# Altium schematic sheet AD9959_OUTPUT.SchDoc
size A4
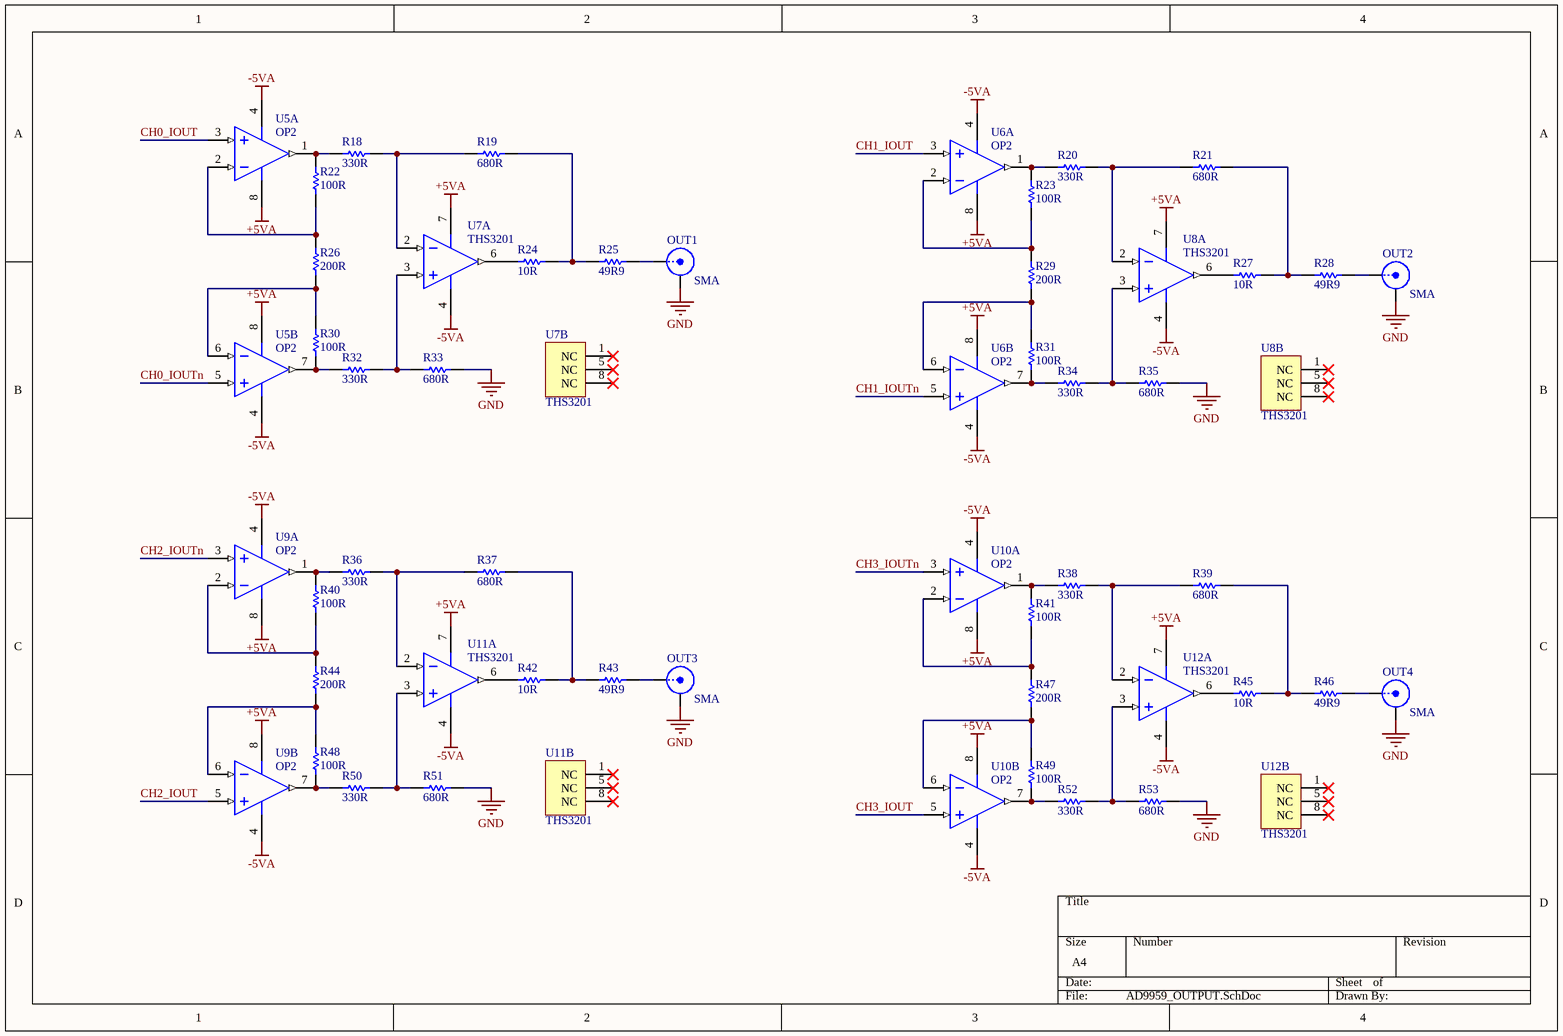
[diagram p0: AD9959_OUTPUT.SchDoc]

## Parts
OUT1  SMA  [SMA-V]
OUT2  SMA  [SMA-V]
OUT3  SMA  [SMA-V]
OUT4  SMA  [SMA-V]
R18  330R  [RESC0603(1608)_M]
R19  680R  [RESC0603(1608)_M]
R20  330R  [RESC0603(1608)_M]
R21  680R  [RESC0603(1608)_M]
R22  100R  [RESC0603(1608)_M]
R23  100R  [RESC0603(1608)_M]
R24  10R  [RESC0603(1608)_M]
R25  49R9  [RESC0603(1608)_M]
R26  200R  [RESC0603(1608)_M]
R27  10R  [RESC0603(1608)_M]
R28  49R9  [RESC0603(1608)_M]
R29  200R  [RESC0603(1608)_M]
R30  100R  [RESC0603(1608)_M]
R31  100R  [RESC0603(1608)_M]
R32  330R  [RESC0603(1608)_M]
R33  680R  [RESC0603(1608)_M]
R34  330R  [RESC0603(1608)_M]
R35  680R  [RESC0603(1608)_M]
R36  330R  [RESC0603(1608)_M]
R37  680R  [RESC0603(1608)_M]
R38  330R  [RESC0603(1608)_M]
R39  680R  [RESC0603(1608)_M]
R40  100R  [RESC0603(1608)_M]
R41  100R  [RESC0603(1608)_M]
R42  10R  [RESC0603(1608)_M]
R43  49R9  [RESC0603(1608)_M]
R44  200R  [RESC0603(1608)_M]
R45  10R  [RESC0603(1608)_M]
R46  49R9  [RESC0603(1608)_M]
R47  200R  [RESC0603(1608)_M]
R48  100R  [RESC0603(1608)_M]
R49  100R  [RESC0603(1608)_M]
R50  330R  [RESC0603(1608)_M]
R51  680R  [RESC0603(1608)_M]
R52  330R  [RESC0603(1608)_M]
R53  680R  [RESC0603(1608)_M]
U5  OP2  [SOIC8]  (parts A,B of 2)
U6  OP2  [SOIC8]  (parts A,B of 2)
U7  THS3201  [SOIC8]  (parts A,B of 2)
U8  THS3201  [SOIC8]  (parts A,B of 2)
U9  OP2  [SOIC8]  (parts A,B of 2)
U10  OP2  [SOIC8]  (parts A,B of 2)
U11  THS3201  [SOIC8]  (parts A,B of 2)
U12  THS3201  [SOIC8]  (parts A,B of 2)

## Nets
+5VA: U5.8(V+) U6.8(V+) U7.7(VS+) U8.7(VS+) U9.8(V+) U10.8(V+) U11.7(VS+) U12.7(VS+)
-5VA: U5.4(V-) U6.4(V-) U7.4(VS-) U8.4(VS-) U9.4(V-) U10.4(V-) U11.4(VS-) U12.4(VS-)
GND: OUT1.2(Y) OUT2.2(Y) OUT3.2(Y) OUT4.2(Y) R33.2 R35.2 R51.2 R53.2
CH0_IOUT: U5.3(IN_A+)
CH0_IOUTn: U5.5(IN_B+)
CH1_IOUT: U6.3(IN_A+)
CH1_IOUTn: U6.5(IN_B+)
CH2_IOUT: U9.5(IN_B+)
CH2_IOUTn: U9.3(IN_A+)
CH3_IOUT: U10.5(IN_B+)
CH3_IOUTn: U10.3(IN_A+)
NetOUT1_1: OUT1.1(X) R25.2
NetOUT2_1: OUT2.1(X) R28.2
NetOUT3_1: OUT3.1(X) R43.2
NetOUT4_1: OUT4.1(X) R46.2
NetR18_1: R18.1 R22.2 U5.1(OUT_A)
NetR18_2: R18.2 R19.1 U7.2(VIN-)
NetR19_2: R19.2 R24.2 R25.1
NetR20_1: R20.1 R23.2 U6.1(OUT_A)
NetR20_2: R20.2 R21.1 U8.2(VIN-)
NetR21_2: R21.2 R27.2 R28.1
NetR22_1: R22.1 R26.2 U5.2(IN_A-)
NetR23_1: R23.1 R29.2 U6.2(IN_A-)
NetR24_1: R24.1 U7.6(VOUT)
NetR26_1: R26.1 R30.2 U5.6(IN_B-)
NetR27_1: R27.1 U8.6(VOUT)
NetR29_1: R29.1 R31.2 U6.6(IN_B-)
NetR30_1: R30.1 R32.1 U5.7(OUT_B)
NetR31_1: R31.1 R34.1 U6.7(OUT_B)
NetR32_2: R32.2 R33.1 U7.3(VIN+)
NetR34_2: R34.2 R35.1 U8.3(VIN+)
NetR36_1: R36.1 R40.2 U9.1(OUT_A)
NetR36_2: R36.2 R37.1 U11.2(VIN-)
NetR37_2: R37.2 R42.2 R43.1
NetR38_1: R38.1 R41.2 U10.1(OUT_A)
NetR38_2: R38.2 R39.1 U12.2(VIN-)
NetR39_2: R39.2 R45.2 R46.1
NetR40_1: R40.1 R44.2 U9.2(IN_A-)
NetR41_1: R41.1 R47.2 U10.2(IN_A-)
NetR42_1: R42.1 U11.6(VOUT)
NetR44_1: R44.1 R48.2 U9.6(IN_B-)
NetR45_1: R45.1 U12.6(VOUT)
NetR47_1: R47.1 R49.2 U10.6(IN_B-)
NetR48_1: R48.1 R50.1 U9.7(OUT_B)
NetR49_1: R49.1 R52.1 U10.7(OUT_B)
NetR50_2: R50.2 R51.1 U11.3(VIN+)
NetR52_2: R52.2 R53.1 U12.3(VIN+)

Not connected (* = marked no-connect by the designer): U7 1(NC)* 5(NC)* 8(NC)*; U8 1(NC)* 5(NC)* 8(NC)*; U11 1(NC)* 5(NC)* 8(NC)*; U12 1(NC)* 5(NC)* 8(NC)*

## Library data of the parts
R18-R53 = RES
OUT1-OUT4 = SMA: LatestRevisionDate: 17-Jul-2002; LatestRevisionNote: Re-released for DXP Platform.; Publisher: Altium Limited